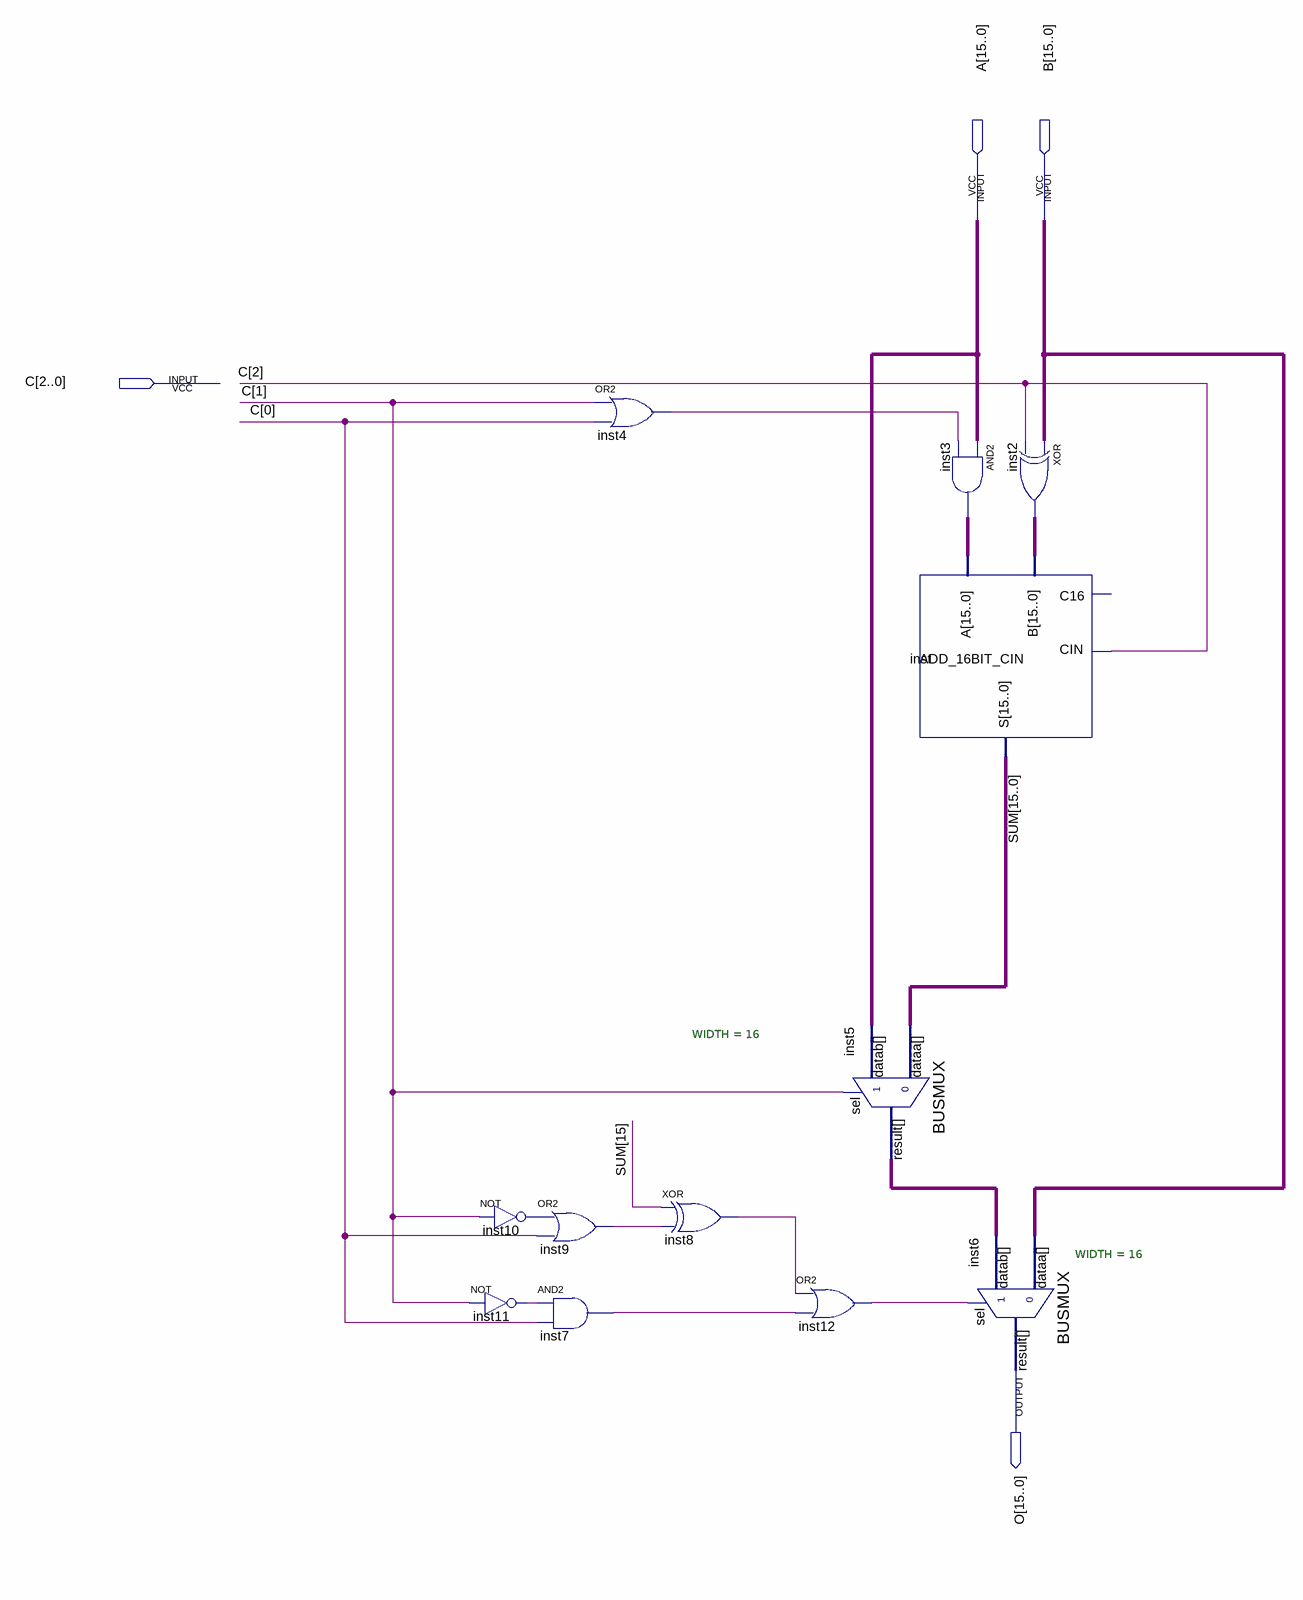
[diagram p0: schematic sheet]
// Quartus schematic AU_NONPIPELINE.bdf as structural Verilog: 12 symbols, 4 pins
module AU_NONPIPELINE (
  input  [15:0] A,
  input  [15:0] B,
  input  [2:0] C,
  output [15:0] O
);

  wire inst4_out, inst7_out, inst8_out, inst9_out, inst10_out, inst11_out, inst12_out;
  wire [15:0] inst2_out, inst3_out, inst5_result, SUM;

  not inst10 (inst10_out, C[1]);
  not inst11 (inst11_out, C[1]);
  or inst9 (inst9_out, inst10_out, C[0]);
  and inst7 (inst7_out, inst11_out, C[0]);
  or inst4 (inst4_out, C[1], C[0]);
  xor inst8 (inst8_out, SUM[15], inst9_out);
  BUSMUX #(.WIDTH(16)) inst5 (.datab(A), .sel(C[1]), .dataa(SUM), .result(inst5_result));
  or inst12 (inst12_out, inst8_out, inst7_out);
  assign inst3_out = A & {16{inst4_out}};  // AND2 inst3, 16 bits wide
  ADD_16BIT_CIN inst (.A(inst3_out), .B(inst2_out), .CIN(C[2]), .S(SUM));  // open: C16
  assign inst2_out = B ^ {16{C[2]}};  // XOR inst2, 16 bits wide
  BUSMUX #(.WIDTH(16)) inst6 (.datab(inst5_result), .sel(inst12_out), .dataa(B), .result(O));
endmodule
